# EAGLE schematic stereo_mix_front (EAGLE 9.4.2)

## Sheet 1 of 2: Channels
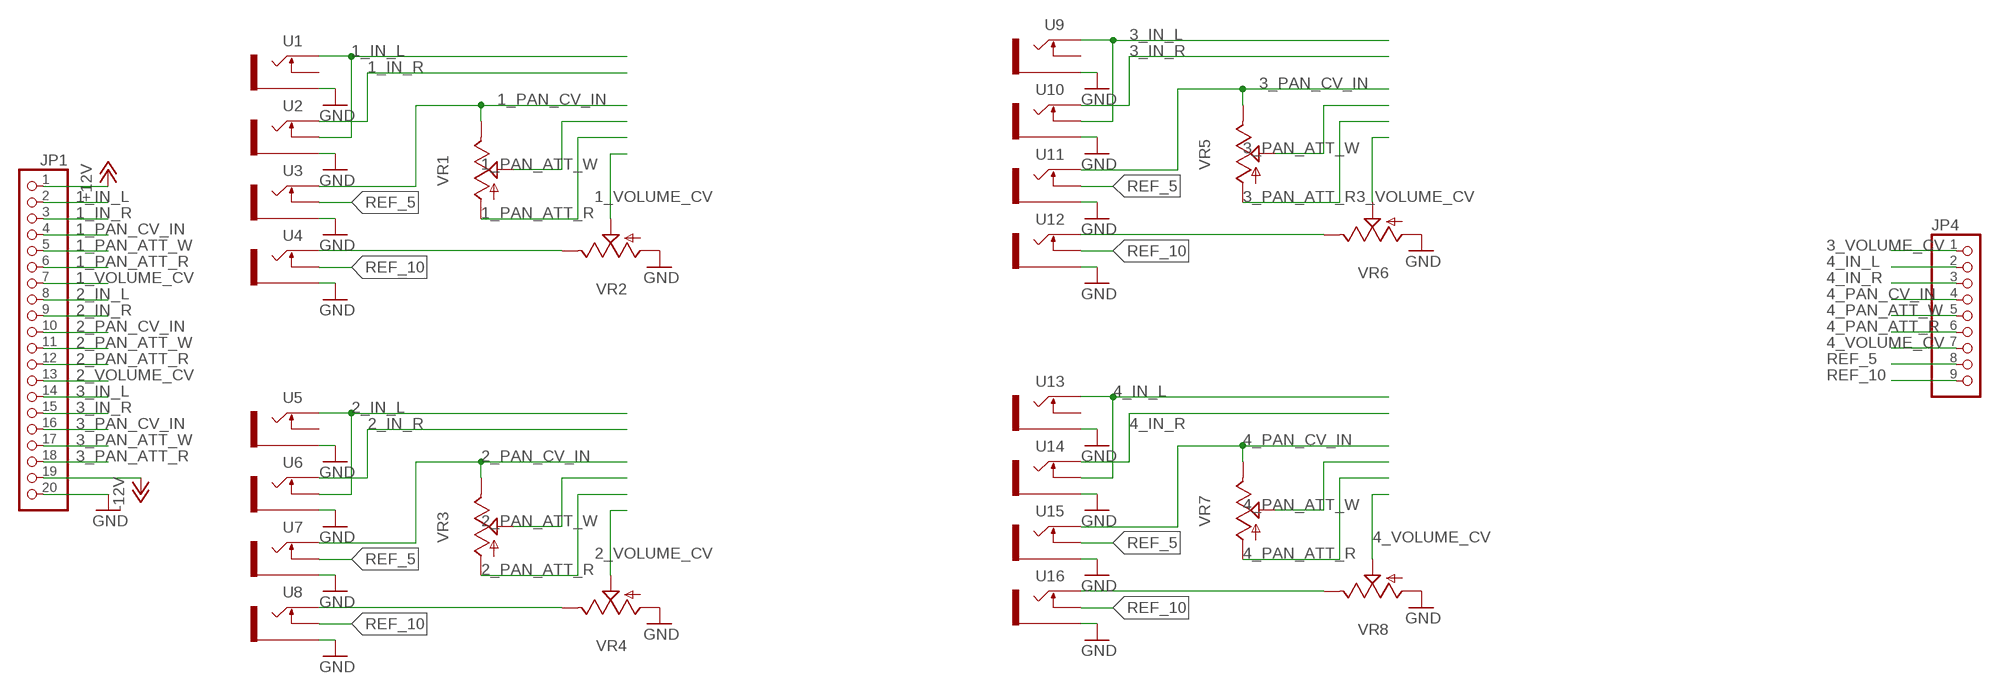
[diagram p0: schematic, sheet 1]

### Parts
JP1  PINHD-1X20  [1X20]
JP4  PINHD-1X9  [1X09]
U1  THONKICONNOLD  [THONKICONN]
U2  THONKICONNOLD  [THONKICONN]
U3  THONKICONNOLD  [THONKICONN]
U4  THONKICONNOLD  [THONKICONN]
U5  THONKICONNOLD  [THONKICONN]
U6  THONKICONNOLD  [THONKICONN]
U7  THONKICONNOLD  [THONKICONN]
U8  THONKICONNOLD  [THONKICONN]
U9  THONKICONNOLD  [THONKICONN]
U10  THONKICONNOLD  [THONKICONN]
U11  THONKICONNOLD  [THONKICONN]
U12  THONKICONNOLD  [THONKICONN]
U13  THONKICONNOLD  [THONKICONN]
U14  THONKICONNOLD  [THONKICONN]
U15  THONKICONNOLD  [THONKICONN]
U16  THONKICONNOLD  [THONKICONN]
VR1  9MM_SNAP-IN_POT_  [9MM_SNAP-IN_POT]
VR2  9MM_SNAP-IN_POT_  [9MM_SNAP-IN_POT]
VR3  9MM_SNAP-IN_POT_  [9MM_SNAP-IN_POT]
VR4  9MM_SNAP-IN_POT_  [9MM_SNAP-IN_POT]
VR5  9MM_SNAP-IN_POT_  [9MM_SNAP-IN_POT]
VR6  9MM_SNAP-IN_POT_  [9MM_SNAP-IN_POT]
VR7  9MM_SNAP-IN_POT_  [9MM_SNAP-IN_POT]
VR8  9MM_SNAP-IN_POT_  [9MM_SNAP-IN_POT]

### Nets
1_IN_L: JP1.2 U1.P$3_TIP(TIP) U2.P$2_SWITCH(SWITCH)
1_IN_R: JP1.3 U2.P$3_TIP(TIP)
1_PAN_ATT_R: JP1.6 VR1.1(A)
1_PAN_ATT_W: JP1.5 VR1.2(S)
1_PAN_CV_IN: JP1.4 U3.P$3_TIP(TIP) VR1.3(E)
1_VOLUME_CV: JP1.7 VR2.2(S)
2_IN_L: JP1.8 U5.P$3_TIP(TIP) U6.P$2_SWITCH(SWITCH)
2_IN_R: JP1.9 U6.P$3_TIP(TIP)
2_PAN_ATT_R: JP1.12 VR3.1(A)
2_PAN_ATT_W: JP1.11 VR3.2(S)
2_PAN_CV_IN: JP1.10 U7.P$3_TIP(TIP) VR3.3(E)
2_VOLUME_CV: JP1.13 VR4.2(S)
3_IN_L: JP1.14 U9.P$3_TIP(TIP) U10.P$2_SWITCH(SWITCH)
3_IN_R: JP1.15 U10.P$3_TIP(TIP)
3_PAN_ATT_R: JP1.18 VR5.1(A)
3_PAN_ATT_W: JP1.17 VR5.2(S)
3_PAN_CV_IN: JP1.16 U11.P$3_TIP(TIP) VR5.3(E)
3_VOLUME_CV: JP4.1 VR6.2(S)
4_IN_L: JP4.2 U13.P$3_TIP(TIP) U14.P$2_SWITCH(SWITCH)
4_IN_R: JP4.3 U14.P$3_TIP(TIP)
4_PAN_ATT_R: JP4.6 VR7.1(A)
4_PAN_ATT_W: JP4.5 VR7.2(S)
4_PAN_CV_IN: JP4.4 U15.P$3_TIP(TIP) VR7.3(E)
4_VOLUME_CV: JP4.7 VR8.2(S)
+12V: JP1.1
-12V: JP1.19
GND: JP1.20 U1.P$1_SLEEVE(SLEEVE) U2.P$1_SLEEVE(SLEEVE) U3.P$1_SLEEVE(SLEEVE) U4.P$1_SLEEVE(SLEEVE) U5.P$1_SLEEVE(SLEEVE) U6.P$1_SLEEVE(SLEEVE) U7.P$1_SLEEVE(SLEEVE) U8.P$1_SLEEVE(SLEEVE) U9.P$1_SLEEVE(SLEEVE) U10.P$1_SLEEVE(SLEEVE) U11.P$1_SLEEVE(SLEEVE) U12.P$1_SLEEVE(SLEEVE) U13.P$1_SLEEVE(SLEEVE) U14.P$1_SLEEVE(SLEEVE) U15.P$1_SLEEVE(SLEEVE) U16.P$1_SLEEVE(SLEEVE) VR2.1(A) VR4.1(A) VR6.1(A) VR8.1(A) ; also sheet 2
N$13: U8.P$3_TIP(TIP) VR4.3(E)
N$17: U4.P$3_TIP(TIP) VR2.3(E)
N$21: U12.P$3_TIP(TIP) VR6.3(E)
N$28: U16.P$3_TIP(TIP) VR8.3(E)
REF_5: JP4.8 U3.P$2_SWITCH(SWITCH) U7.P$2_SWITCH(SWITCH) U11.P$2_SWITCH(SWITCH) U15.P$2_SWITCH(SWITCH)
REF_10: JP4.9 U4.P$2_SWITCH(SWITCH) U8.P$2_SWITCH(SWITCH) U12.P$2_SWITCH(SWITCH) U16.P$2_SWITCH(SWITCH)
Unconnected: U1.P$2_SWITCH(SWITCH) U5.P$2_SWITCH(SWITCH) U9.P$2_SWITCH(SWITCH) U13.P$2_SWITCH(SWITCH)

## Sheet 2 of 2: Output
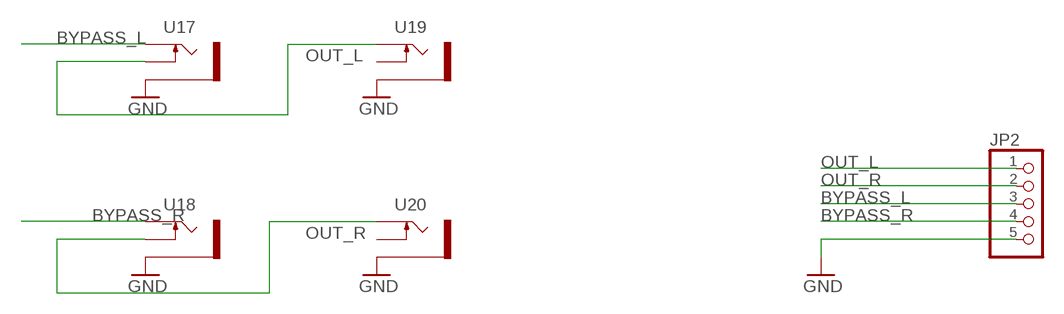
[diagram p1: schematic, sheet 2]

### Parts
JP2  PINHD-1X5  [1X05]
U17  THONKICONNOLD  [THONKICONN]
U18  THONKICONNOLD  [THONKICONN]
U19  THONKICONNOLD  [THONKICONN]
U20  THONKICONNOLD  [THONKICONN]

### Nets
BYPASS_L: JP2.3 U17.P$3_TIP(TIP)
BYPASS_R: JP2.4 U18.P$3_TIP(TIP)
GND: JP2.5 U17.P$1_SLEEVE(SLEEVE) U18.P$1_SLEEVE(SLEEVE) U19.P$1_SLEEVE(SLEEVE) U20.P$1_SLEEVE(SLEEVE) ; also sheet 1
OUT_L: JP2.1 U17.P$2_SWITCH(SWITCH) U19.P$3_TIP(TIP)
OUT_R: JP2.2 U18.P$2_SWITCH(SWITCH) U20.P$3_TIP(TIP)
Unconnected: U19.P$2_SWITCH(SWITCH) U20.P$2_SWITCH(SWITCH)

## Library data of the parts
JP1 = pinhead:PINHD-1X20: PIN HEADER
JP2 = pinhead:PINHD-1X5: PIN HEADER
JP4 = pinhead:PINHD-1X9: PIN HEADER
U1-U20 = MusicThingModular:THONKICONN: 3.5mm socket for Eurorack modular synths
VR1-VR8 = MusicThingModular:9MM_SNAP-IN_POT: 9mm vertical snap-in pot, Alpha / Panasonic style; SPICEPREFIX: J